# Altium schematic sheet DisplayBoard.SchDoc: Mantra Display Board
size A4; Author: MikrySoft; Address1: MikrySoft@gmail.com; DocumentNumber: 1; Revision: 1; SheetNumber: 1; SheetTotal: 7
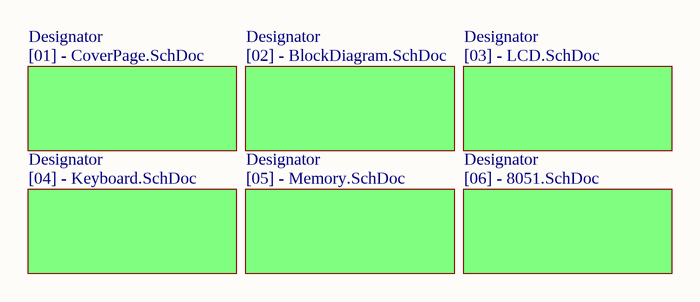
[diagram p0: DisplayBoard.SchDoc]

## Sub-sheets
Designator = [01] - CoverPage.SchDoc: no entries
Designator = [04] - Keyboard.SchDoc: no entries
Designator = [02] - BlockDiagram.SchDoc: no entries
Designator = [05] - Memory.SchDoc: no entries
Designator = [03] - LCD.SchDoc: no entries
Designator = [06] - 8051.SchDoc: no entries

## Notes on the sheet
- Title
- Size:
- Date:
- A4
- Number:
- Time:
- Revision:
- Sheet
- of
- Variation:
- Author:
- E-Mail:
- File: